# Altium schematic sheet InclinometerMain.SchDoc
size 420 x 297 mm; Address1: Address1; Address2: Address2; Address3: Address3; Address4: Address4; DocumentNumber: АБВГ.123456.001 Э3; SheetNumber: 1; Scale: 1:1; DocumentType: Схема электрическая принципиальная; FirstReferrence: АБВГ.123456.001
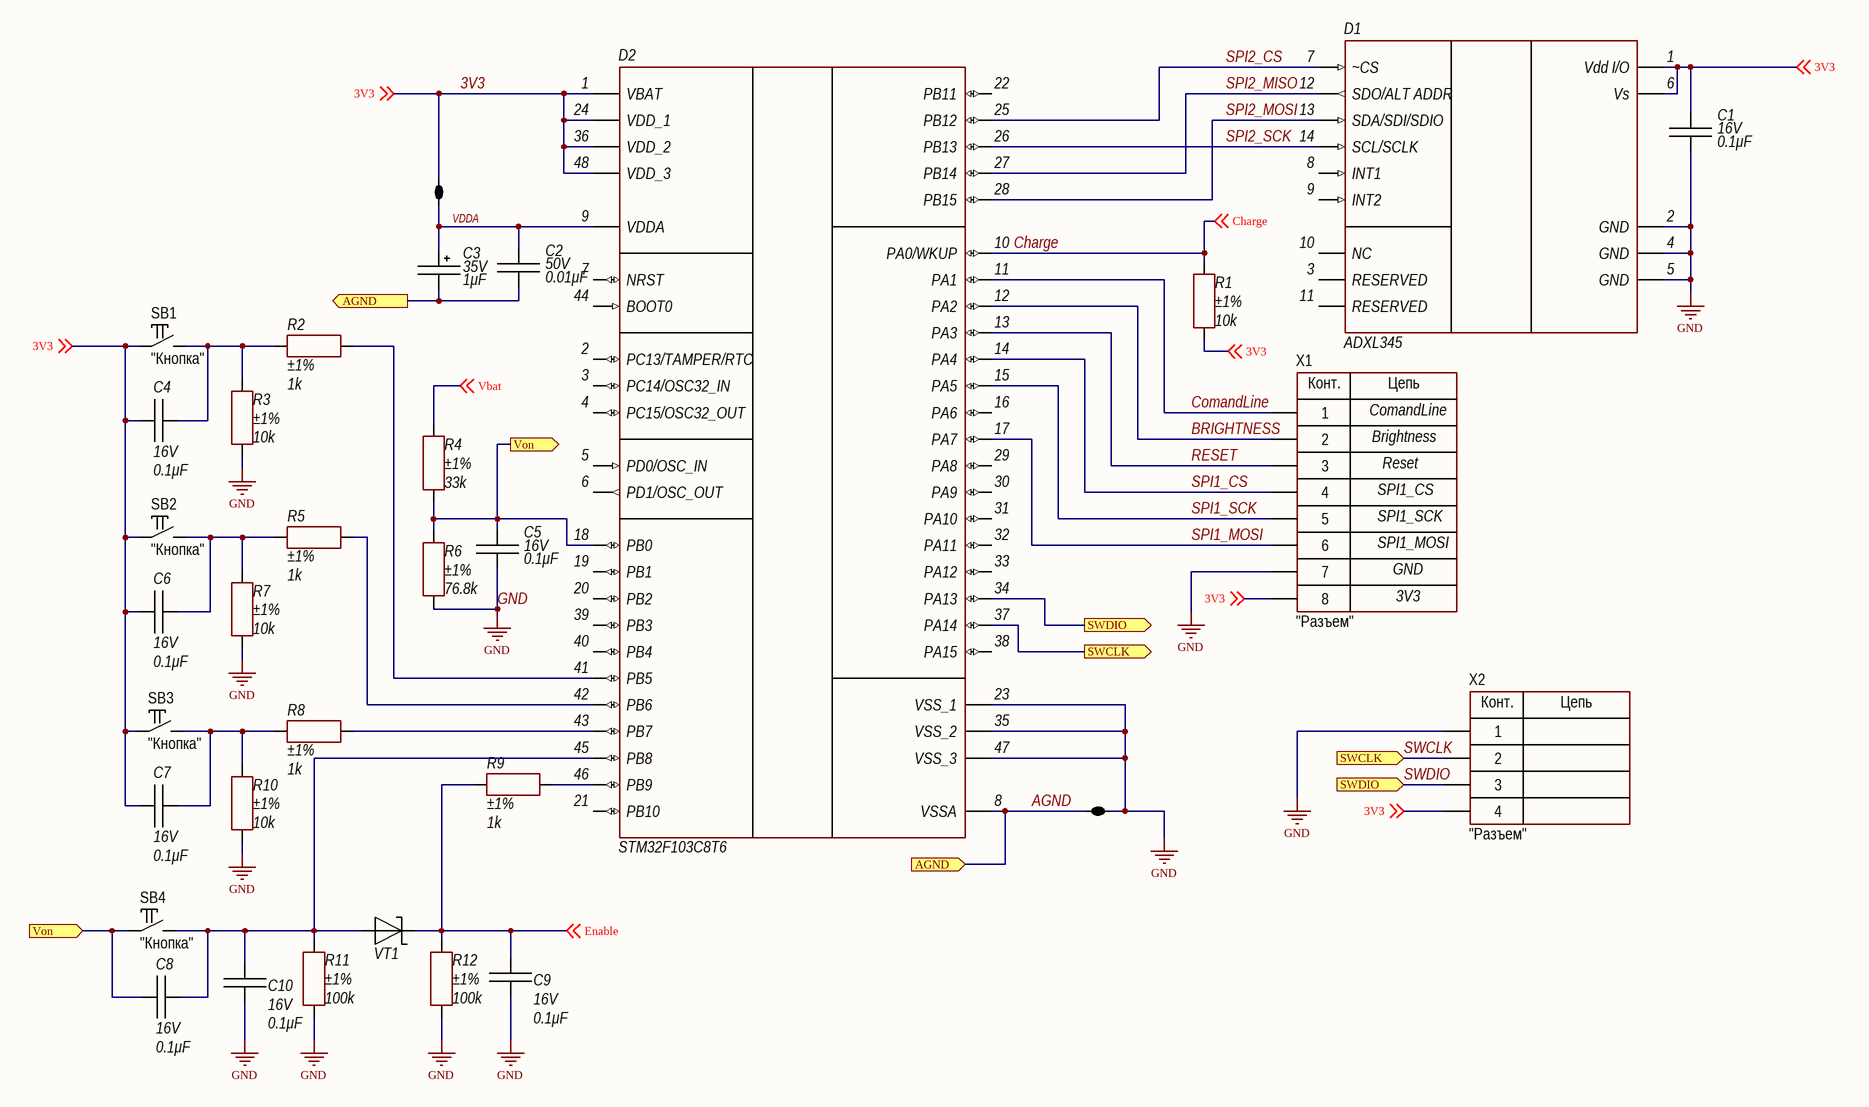
[diagram p0: InclinometerMain.SchDoc]

## Parts
C1  value 0.1μF  Voltage: 16V  [CAP: 0603]
C2  value 0.01μF  Voltage: 50V  [CAP: 0603]
C3  value 1μF  Voltage: 35V  [CAP: TANTAL-A]
C4  value 0.1μF  Voltage: 16V  [CAP: 0603]
C5  value 0.1μF  Voltage: 16V  [CAP: 0603]
C6  value 0.1μF  Voltage: 16V  [CAP: 0603]
C7  value 0.1μF  Voltage: 16V  [CAP: 0603]
C8  value 0.1μF  Voltage: 16V  [CAP: 0603]
C9  value 0.1μF  Voltage: 16V  [CAP: 0603]
C10  value 0.1μF  Voltage: 16V  [CAP: 0603]
D1  ADXL345  [ADXL345]
D2  STM32F103C8T6  [LQFP48]
J1  2 way net tie junction  [2way_MP]  (value not drawn)  (net tie, no BOM)
J2  2 way net tie junction  [2way_MP]  (value not drawn)  (net tie, no BOM)
R1  value 10k  Tolerance: ±1%  [RES: 0603]
R2  value 1k  Tolerance: ±1%  [RES: 0603]
R3  value 10k  Tolerance: ±1%  [RES: 0603]
R4  value 33k  Tolerance: ±1%  [RES: 0603]
R5  value 1k  Tolerance: ±1%  [RES: 0603]
R6  value 76.8k  Tolerance: ±1%  [RES: 0603]
R7  value 10k  Tolerance: ±1%  [RES: 0603]
R8  value 1k  Tolerance: ±1%  [RES: 0603]
R9  value 1k  Tolerance: ±1%  [RES: 0603]  (hidden comment: Resistor film, 2k, ±1%, 0603, 0.1W, -55...+155°C)
R10  value 10k  Tolerance: ±1%  [RES: 0603]
R11  value 100k  Tolerance: ±1%  [RES: 0603]  (hidden comment: Resistor film, 100k, ±5%, 0603, 0.1W, -55...+155°C)
R12  value 100k  Tolerance: ±1%  [RES: 0603]  (hidden comment: Resistor film, 1M, ±5%, 0603, 0.1W, -55...+155°C)
SB1  CommentText: "Кнопка"  [BUT: 6x6]
SB2  CommentText: "Кнопка"  [BUT: 6x6]
SB3  CommentText: "Кнопка"  [BUT: 6x6]
SB4  CommentText: "Кнопка"  [BUT: 6x6]
VT1  MOSFET P-channel transistor, -20V, -2.8A, 7.7nC, 4.16W, 58mOhm, 744pF, SOT23, -55...+150°C  [SOT23]  (value not drawn)
X1  CommentText: "Разъем"  [CON: PBS-8]
X2  CommentText: "Разъем"  [CON: PLS-4]

## Ports
AGND (in), AGND (out), SWCLK (in), SWCLK (out), SWDIO (in), SWDIO (out), Von (in), Von (out)

## Nets
GND: C1.1 C5.1 C9.1 C10.1 D1.2(GND) D1.4(GND) D1.5(GND) D2.23(VSS_1) D2.35(VSS_2) D2.47(VSS_3) J2.2 R3.1 R6.1 R7.1 R10.1 R11.2 R12.1 X1.7 X2.1
3V3: C1.2 C4.1 C6.1 C7.1 D1.1(Vdd_I/O) D1.6(Vs) D2.1(VBAT) D2.24(VDD_1) D2.36(VDD_2) D2.48(VDD_3) J1.1 R1.1 SB1.1 SB2.1 SB3.1 X1.8 X2.4 ; off-sheet 3V3
AGND: C2.1 C3.2 D2.8(VSSA) J2.1 ; port AGND
BRIGHTNESS: D2.12(PA2) X1.2
Charge: D2.10(PA0/WKUP) R1.2 ; off-sheet Charge
ComandLine: D2.11(PA1) X1.1
Enable: C9.2 R9.1 R12.2 VT1.3 ; off-sheet Enable
RESET: D2.13(PA3) X1.3
SPI1_CS: D2.14(PA4) X1.4
SPI1_MOSI: D2.17(PA7) X1.6
SPI1_SCK: D2.15(PA5) X1.5
SPI2_CS: D1.7(~CS) D2.25(PB12)
SPI2_MISO: D1.12(SDO/ALT_ADDR) D2.27(PB14)
SPI2_MOSI: D1.13(SDA/SDI/SDIO) D2.28(PB15)
SPI2_SCK: D1.14(SCL/SCLK) D2.26(PB13)
SWCLK: D2.37(PA14) X2.2 ; port SWCLK
SWDIO: D2.34(PA13) X2.3 ; port SWDIO
Vbat: R4.2 ; off-sheet Vbat
VDDA: C2.2 C3.1 D2.9(VDDA) J1.2
Von: C5.2 C8.1 D2.18(PB0) R4.1 R6.2 SB4.1 ; port Von
NetC4_2: C4.2 R2.1 R3.2 SB1.2
NetC6_2: C6.2 R5.1 R7.2 SB2.2
NetC7_2: C7.2 R8.1 R10.2 SB3.2
NetC8_2: C8.2 C10.2 D2.45(PB8) R11.1 SB4.2 VT1.1
NetD2_41: D2.41(PB5) R2.2
NetD2_42: D2.42(PB6) R5.2
NetD2_43: D2.43(PB7) R8.2
NetD2_46: D2.46(PB9) R9.2

Not connected (* = marked no-connect by the designer): D1 3(RESERVED) 8(INT1) 9(INT2) 10(NC) 11(RESERVED); D2 2(PC13/TAMPER/RTC) 3(PC14/OSC32_IN) 4(PC15/OSC32_OUT) 5(PD0/OSC_IN) 6(PD1/OSC_OUT) 7(NRST) 16(PA6) 19(PB1) 20(PB2) 21(PB10) 22(PB11) 29(PA8) 30(PA9) 31(PA10) 32(PA11) 33(PA12) 38(PA15) 39(PB3) 40(PB4) 44(BOOT0)

## Notes on the sheet
- ComandLine
- Brightness
- SPI1_CS
- Reset
- SPI1_SCK
- SPI1_MOSI
- GND
- 3V3
- Перв. примен.
- Справ. №
- Подп. и дата
- Инв. № дубл.
- Взам. инв. №
- Разраб.
- Изм.
- Лист
- № докум.
- Подп.
- Дата
- Лит.
- Масса
- Масштаб
- Пров.
- Т.контр.
- Листов
- Инв. № подл.
- Утв.
- Н.контр.
- 2.106-A3
- Копировал
- Формат А3
- (in symbol PBS-8) Конт.; Цепь
- (in symbol PLS-4) Конт.; Цепь

## Library data of the parts
C1 C4-C10 = Ceramic_0603: Manufacturer: Murata Electronics; PartNumber: GRM188R71C104KA01D; ValueManufacturerPartNumber: Ceramic capacitor, 0.1μF, X7R, ±10%, 16V, 0603, -55...+125°C; TypeCapacitor: Ceramic capacitor; Tolerance: ±10%; TypeDielectric: X7R; Package: 0603; HelpURL: https://www.digikey.com/product-detail/en/murata-electronics/GRM188R71C104KA01D/490-1532-2-ND/587060; Temperature: -55...+125°C
C2 = Ceramic_0603: Manufacturer: Murata Electronics; PartNumber: GRM188R71H103KA01D; ValueManufacturerPartNumber: Ceramic capacitor, 0.01μF, X7R, ±10%, 50V, 0603, -55...+125°C; TypeCapacitor: Ceramic capacitor; Tolerance: ±10%; TypeDielectric: X7R; Package: 0603; HelpURL: https://www.digikey.com/product-detail/en/murata-electronics/GRM188R71H103KA01D/490-1512-2-ND/587151; Temperature: -55...+125°C
C3 = Tantal_A: Manufacturer: AVX; PartNumber: TAJA105K035RNJ; ValueManufacturerPartNumber: Tantalum capacitor, 1μF, 35V, ±10%, 7.5Ohm, case A (3216), -55...+125°C; Impedance: 7.5Ohm; Tolerance: ±10%; TypeCapacitor: Tantalum capacitor; Package: case A (3216); HelpURL: https://www.digikey.com/product-detail/en/avx-corporation/TAJA105K035RNJ/478-1651-2-ND/563759; Temperature: -55...+125°C
D1 = ADXL345: Axlerometer sensor; Manufacture: Analog Device; Help URL: https://www.analog.com/media/en/technical-documentation/data-sheets/ADXL345.pdf; Case: СС-14-1; Model: ADXL345
D2 = STM32F103C8T6: 32bit microcontroller; Manufacture: ST; Case: LQFP48 (7x7mm); Model: STM32F103C8T6
J1 J2 = 2way: ComponentLink1URL: http://www.edatools.cz/addons; ComponentLink1Description: Source; FootprintNote: LP=12mil, MP=40mil, HP=120mil
R1 R3 R7 R10 = Resistor_0603: Manufacturer: Yageo; PartNumber: RC0603FR-0710KL; ValueManufacturerPartNumber: Resistor film, 10k, ±1%, 0603, 0.1W, -55...+155°C; TypeResistor: Resistor film; Power: 0.1W; Package: 0603; HelpURL: https://www.digikey.com/product-detail/en/yageo/RC0603FR-0710KL/311-10-0KHRCT-ND/729827; Temperature: -55...+155°C
R2 R5 R8 = Resistor_0603: Manufacturer: Yageo; PartNumber: RC0603FR-071KL; ValueManufacturerPartNumber: Resistor film, 1k, ±1%, 0603, 0.1W, -55...+155°C; TypeResistor: Resistor film; Power: 0.1W; Package: 0603; HelpURL: https://www.digikey.com/product-detail/en/yageo/RC0603FR-071KL/311-1-00KHRCT-ND/729790; Temperature: -55...+155°C
R4 = Resistor_0603: Manufacturer: Yageo; PartNumber: RC0603JR-0733KL; ValueManufacturerPartNumber: Resistor film, 33k, ±1%, 0603, 0.1W, -55...+155°C; TypeResistor: Resistor film; Power: 0.1W; Package: 0603; HelpURL: https://www.digikey.com/product-detail/en/yageo/RC0603FR-0720KL/311-20-0KHRCT-ND/729987; Temperature: -55...+155°C
R6 = Resistor_0603: Manufacturer: Yageo; PartNumber: RC0603FR-0776K8L; ValueManufacturerPartNumber: Resistor film, 76.8k, ±1%, 0603, 0.1W, -55...+155°C; TypeResistor: Resistor film; Power: 0.1W; Package: 0603; HelpURL: https://www.digikey.com/product-detail/en/yageo/RC0603FR-0710KL/311-10-0KHRCT-ND/729827; Temperature: -55...+155°C
R9 = Resistor_0603: Manufacturer: Yageo; PartNumber: RC0603FR-071KL; ValueManufacturerPartNumber: Resistor film, 1k, ±1%, 0603, 0.1W, -55...+155°C; Package: 0603; HelpURL: https://www.digikey.com/product-detail/en/yageo/RC0603FR-071KL/311-1-00KHRCT-ND/729790; Temperature: -55...+155°C; TypeResistor: Resistor film; Power: 0.1W
R11 R12 = Resistor_0603: Manufacturer: Yageo; PartNumber: RC0603FR-07100KL; ValueManufacturerPartNumber: Resistor film, 100k, ±1%, 0603, 0.1W, -55...+155°C; Package: 0603; HelpURL: https://www.digikey.com/product-detail/en/yageo/RC0603FR-0710KL/311-10-0KHRCT-ND/729827; Temperature: -55...+155°C; TypeResistor: Resistor film; Power: 0.1W
SB1-SB4 = Button_tactile: Manufacturer: TE Connectivity; ValueManufacturerPartNumber: Tactile button, 6x6mm; PartNumber: FSM2JSMAATR; TypeButton: Tactile button; HelpURL: https://www.digikey.com/product-detail/en/te-connectivity-alcoswitch-switches/FSM2JSMAATR/450-1792-1-ND/3503931; Package: 6x6mm
VT1 = BAT54.215: Schottky diode; Manufacture: Nexperia; Model: BAT54.215; Help URL: https://assets.nexperia.com/documents/data-sheet/BAT54_SER.pdf; Case: TO236/SOT23
X1 = PBS-8: Manufacturer: Connfly; ValueManufacturerPartNumber: Connector, 8pin, 2.54mm, 500VAC, 3A; TypeConnector: Connector; VoltageMax: 500VAC; Pitch: 2.54mm; CurrentMax: 3A; Multichannel: 8pin; HelpURL: https://www.chipdip.ru/product/pbs-8; PartNumber: PBS-8
X2 = PLS-4: Manufacturer: Connfly; ValueManufacturerPartNumber: Connector, 4pin, 2.54mm, 500VAC, 3A; TypeConnector: Connector; VoltageMax: 500VAC; Pitch: 2.54mm; CurrentMax: 3A; Multichannel: 4pin; HelpURL: https://www.chipdip.ru/product/pls-4; PartNumber: PLS-4